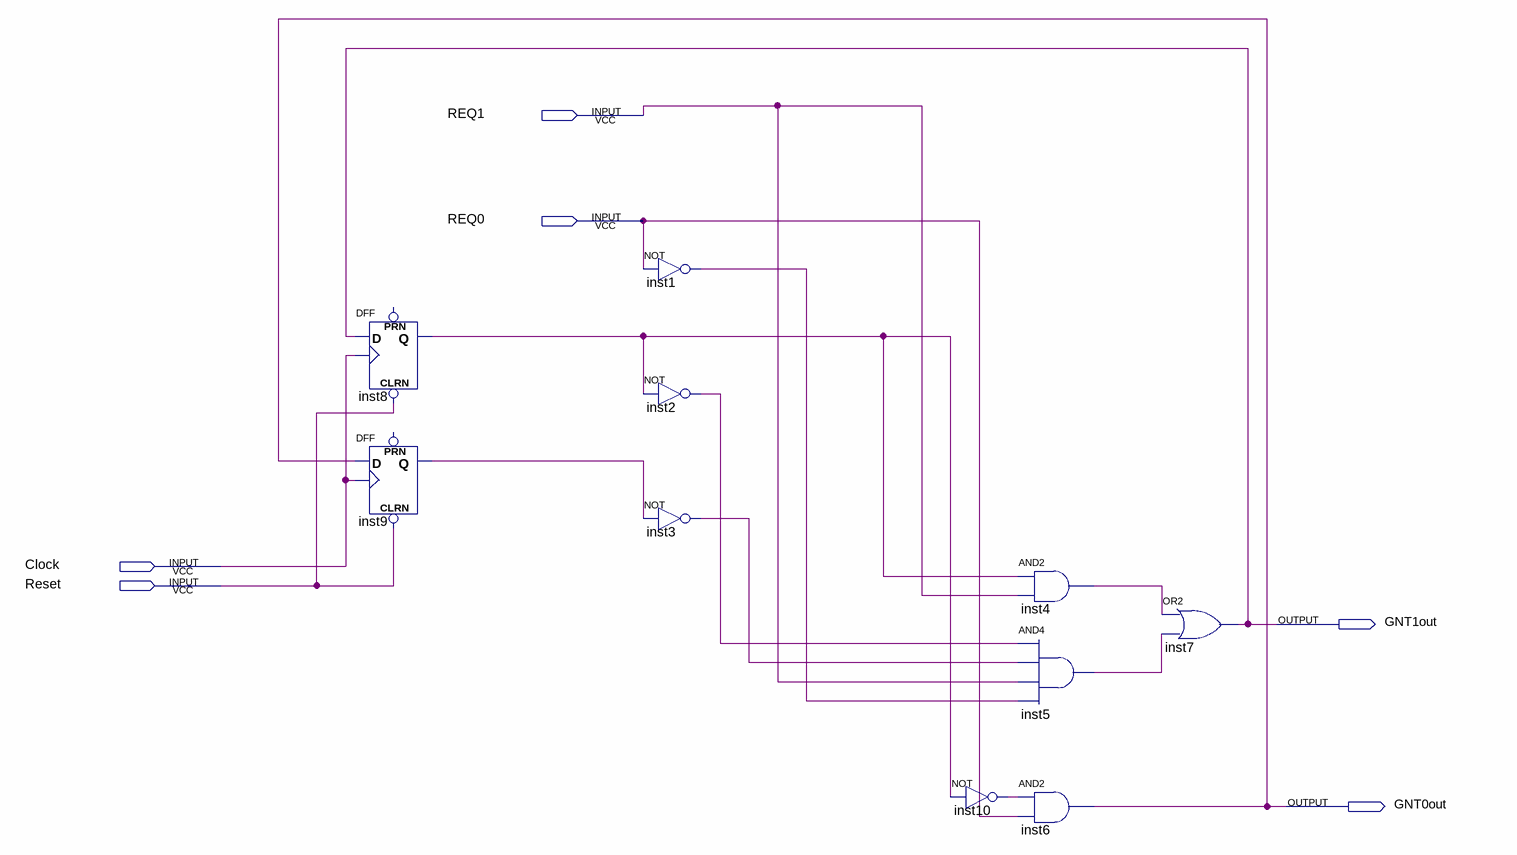
[diagram p0: schematic sheet]
// Quartus schematic arbiter.bdf as structural Verilog: 10 symbols, 6 pins
module arbiter (
  input  REQ1,
  input  REQ0,
  input  Clock,
  input  Reset,
  output GNT1out,
  output GNT0out
);

  wire inst1_out, inst2_out, inst3_out, inst4_out, inst5_out, inst8_q, inst9_q, inst10_out;

  DFF inst8 (.CLRN(Reset), .CLK(Clock), .D(GNT1out), .Q(inst8_q));  // open: PRN
  DFF inst9 (.CLRN(Reset), .CLK(Clock), .D(GNT0out), .Q(inst9_q));  // open: PRN
  not inst1 (inst1_out, REQ0);
  not inst2 (inst2_out, inst8_q);
  not inst3 (inst3_out, inst9_q);
  not inst10 (inst10_out, inst8_q);
  and inst4 (inst4_out, inst8_q, REQ1);
  and inst5 (inst5_out, inst2_out, inst3_out, REQ1, inst1_out);
  and inst6 (GNT0out, inst10_out, REQ0);
  or inst7 (GNT1out, inst4_out, inst5_out);
endmodule
